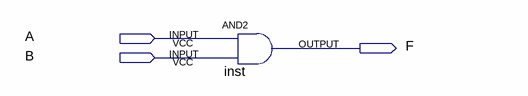
[diagram p0: schematic sheet]
// Quartus schematic circuit_and.bdf as structural Verilog: 1 symbols, 3 pins
module circuit_and (
  input  A,
  input  B,
  output F
);

  and inst (F, A, B);
endmodule
